# Altium project SwiftCtrl.PrjPcb
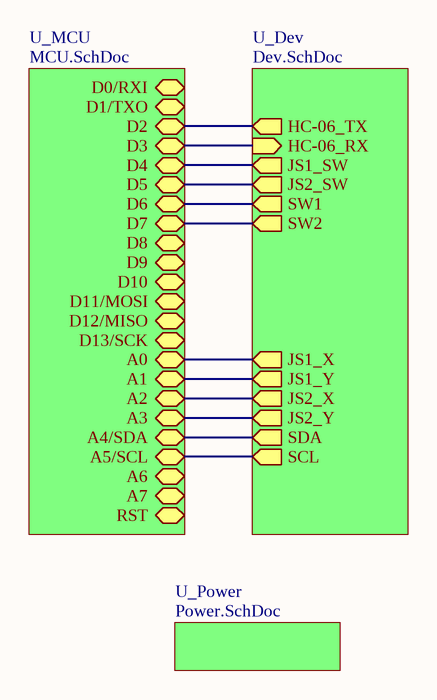
[diagram p0: SwiftCtrl.SchDoc]
4 sheets, 62 parts. Net scope: hierarchical (ports join the sheet entries above them; power ports are global).
Board file: SwiftCtrl.PcbDoc
Sheets:
  SwiftCtrl.SchDoc
    U_Dev = Dev.SchDoc
    U_Power = Power.SchDoc
    U_MCU = MCU.SchDoc

## Sheet SwiftCtrl.SchDoc
size 292 x 193 mm; Author: Power Lin; DocumentNumber: 1; SheetNumber: 1; SheetTotal: 4; Website: wiki-power.com

### Sub-sheets
U_Dev = Dev.SchDoc: JS1_SW (out), JS1_Y (out), JS1_X (out), JS2_SW (out), JS2_Y (out), JS2_X (out), SDA (out), SCL (out), HC-06_TX (out), HC-06_RX (in), SW1 (out), SW2 (out)
U_MCU = MCU.SchDoc: D2 (bidir), D3 (bidir), D4 (bidir), D5 (bidir), D6 (bidir), D7 (bidir), A6 (bidir), A7 (bidir), D8 (bidir), D9 (bidir), D12/MISO (bidir), D10 (bidir), D11/MOSI (bidir), A0 (bidir), A1 (bidir), A4/SDA (bidir), A5/SCL (bidir), A2 (bidir), A3 (bidir), D13/SCK (bidir), RST (bidir), D0/RXI (bidir), D1/TXO (bidir)
U_Power = Power.SchDoc: no entries

### Nets
NetC9_2: sheet U_Dev/JS1_SW, sheet U_MCU/D4
NetC10_2: sheet U_Dev/JS2_SW, sheet U_MCU/D5
NetC11_2: sheet U_Dev/JS1_Y, sheet U_MCU/A1
NetC12_1: sheet U_Dev/JS2_Y, sheet U_MCU/A3
NetC13_1: sheet U_Dev/JS1_X, sheet U_MCU/A0
NetC14_2: sheet U_Dev/JS2_X, sheet U_MCU/A2
NetM1_3: sheet U_Dev/SCL, sheet U_MCU/A5/SCL
NetM1_4: sheet U_Dev/SDA, sheet U_MCU/A4/SDA
NetM2_1: sheet U_Dev/HC-06_TX, sheet U_MCU/D2
NetM2_2: sheet U_Dev/HC-06_RX, sheet U_MCU/D3
NetR9_1: sheet U_Dev/SW1, sheet U_MCU/D6
NetR11_1: sheet U_Dev/SW2, sheet U_MCU/D7

### Notes on the sheet
- Author
- DocumentName
- ModifiedDate
- ProjectName
- SheetNumber
- SheetTotal
- Website
- Revision

## Sheet Dev.SchDoc
size 292 x 193 mm; Author: Power Lin; DocumentNumber: 3; SheetNumber: 3; SheetTotal: 4; Website: wiki-power.com
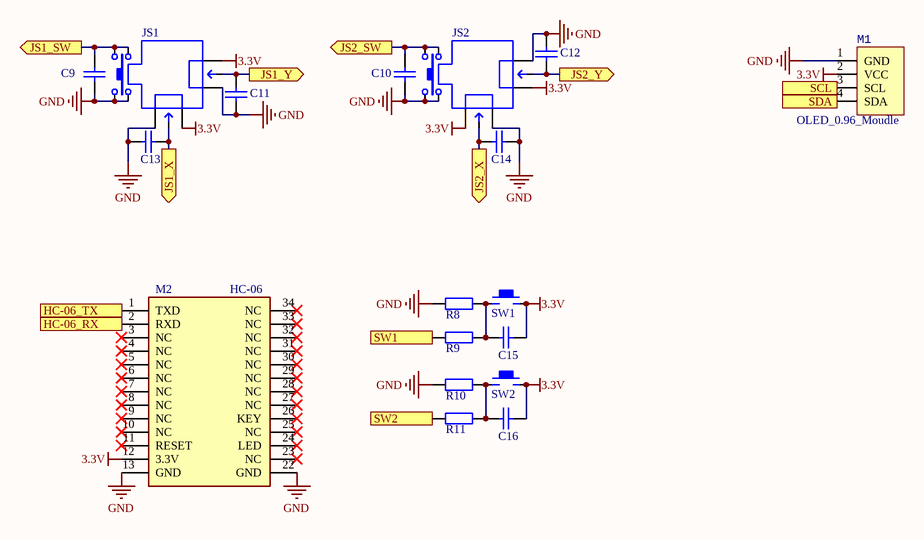
[diagram p1: Dev.SchDoc]

### Parts
C9  220pF  [CAP-0603]  (value not drawn)
C10  220pF  [CAP-0603]  (value not drawn)
C11  220pF  [CAP-0603]  (value not drawn)
C12  220pF  [CAP-0603]  (value not drawn)
C13  220pF  [CAP-0603]  (value not drawn)
C14  220pF  [CAP-0603]  (value not drawn)
C15  100nF  [CAP-0603]  (value not drawn)
C16  100nF  [CAP-0603]  (value not drawn)
JS1  JoyStick  [JoyStick]  (value not drawn)
JS2  JoyStick  [JoyStick]  (value not drawn)
M1  OLED_0.96_Moudle  [OLED_0.96_Moudle]
M2  HC-06  [HC-05/06/08V15]
R8  4.7k  [R-0603]  (value not drawn)
R9  1k  [R-0603]  (value not drawn)
R10  4.7k  [R-0603]  (value not drawn)
R11  1k  [R-0603]  (value not drawn)
SW1  KEY  [KEY_12*12*7.3]  (value not drawn)
SW2  KEY  [KEY_12*12*7.3]  (value not drawn)

### Ports
HC-06_RX (in), HC-06_TX (out), JS1_SW (out), JS1_X (out), JS1_Y (out), JS2_SW (out), JS2_X (out), JS2_Y (out), SCL (out), SDA (out), SW1 (out), SW2 (out)

### Nets
3.3V: C15.2 C16.2 JS1.3 JS1.6 JS2.1 JS2.4 M1.2(VCC) M2.12(3.3V) SW1.2 SW2.2
GND: C9.1 C10.1 C11.1 C12.2 C13.2 C14.1 JS1.1 JS1.4 JS1.8 JS1.10 JS2.3 JS2.6 JS2.8 JS2.10 M1.1(GND) M2.13(GND) M2.22(GND) R8.1 R10.1
NetC9_2: C9.2 JS1.7 JS1.9 ; port JS1_SW
NetC10_2: C10.2 JS2.7 JS2.9 ; port JS2_SW
NetC11_2: C11.2 JS1.5 ; port JS1_Y
NetC12_1: C12.1 JS2.5 ; port JS2_Y
NetC13_1: C13.1 JS1.2 ; port JS1_X
NetC14_2: C14.2 JS2.2 ; port JS2_X
NetC15_1: C15.1 R8.2 R9.2 SW1.1
NetC16_1: C16.1 R10.2 R11.2 SW2.1
NetM1_3: M1.3(SCL) ; port SCL
NetM1_4: M1.4(SDA) ; port SDA
NetM2_1: M2.1(TXD) ; port HC-06_TX
NetM2_2: M2.2(RXD) ; port HC-06_RX
NetR9_1: R9.1 ; port SW1
NetR11_1: R11.1 ; port SW2

Not connected (* = marked no-connect by the designer): M2 3(NC)* 4(NC)* 5(NC)* 6(NC)* 7(NC)* 8(NC)* 9(NC)* 10(NC)* 11(RESET)* 23(NC)* 24(LED)* 25(NC)* 26(KEY)* 27(NC)* 28(NC)* 29(NC)* 30(NC)* 31(NC)* 32(NC)* 33(NC)* 34(NC)*

### Notes on the sheet
- Author
- DocumentName
- ModifiedDate
- ProjectName
- SheetNumber
- SheetTotal
- Website
- Revision

### Library data of the parts
C9-C16 = CAP: 贴片电容; ComponentLink1Description: 供应商链接; ComponentLink1URL: http://www.szlcsc.com/product/details_53938.html; Package: 0402; Supplier: LC; SuppliersPartNumber: C52923
JS1 JS2 = JoyStick: 摇杆
M1 = OLED_0.96_Moudle: OLED 屏
M2 = HC-05/06: HC05/06 蓝牙模块（贴片）; Manufacturer_Name: FTDI Chip; Manufacturer_Part_Number: FT232RL; Datasheet Link: http://www.ftdichip.com/Support/Documents/DataSheets/ICs/DS_FT232R.pdf; Height: 2mm; RS Part Number: 0406580P; RS Price/Stock: http://uk.rs-online.com/web/p/products/0406580P
R8-R11 = RES: 贴片电阻; Package: 0805; Supplier: LC; SuppliersPartNumber: C17798
SW1 SW2 = KEY: 按键开关

## Sheet Power.SchDoc
size 292 x 193 mm; Author: Power Lin; DocumentNumber: 4; SheetNumber: 4; SheetTotal: 4; Website: wiki-power.com
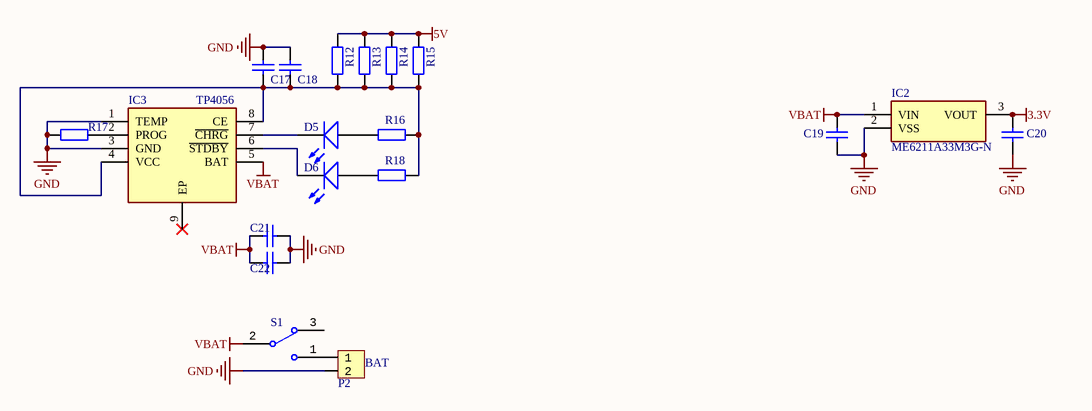
[diagram p2: Power.SchDoc]

### Parts
C17  10nF  [CAP-0603]  (value not drawn)
C18  100nF  [CAP-0603]  (value not drawn)
C19  1uF  [CAP-0603]  (value not drawn)
C20  1uF  [CAP-0603]  (value not drawn)
C21  100nF  [CAP-0603]  (value not drawn)
C22  10nF  [CAP-0603]  (value not drawn)
D5  RED  [LED-0603]  (value not drawn)
D6  RED  [LED-0603]  (value not drawn)
IC2  ME6211A33M3G-N  [SOT-23-3]
IC3  TP4056  [MSOP_E120_P0.5_10]
P2  HDR1x2_2.54  [HDR1X2_2.54_90]  (value not drawn)
R12  1R  [R-0603]  (value not drawn)
R13  1R  [R-0603]  (value not drawn)
R14  1R  [R-0603]  (value not drawn)
R15  1R  [R-0603]  (value not drawn)
R16  2K  [R-0603]  (value not drawn)
R17  1.2K  [R-0603]  (value not drawn)
R18  10K  [R-0603]  (value not drawn)
S1  Switch_SPDT  [SwitchSPDT_2.8X6.6_90]  (value not drawn)

### Nets
3.3V: C20.2 IC2.3(VOUT)
5V: R12.2 R13.2 R14.2 R15.2
GND: C17.2 C18.2 C19.1 C20.1 C21.1 C22.1 IC2.2(VSS) IC3.1(TEMP) IC3.3(GND) P2.2 R17.1
VBAT: C19.2 C21.2 C22.2 IC2.1(VIN) IC3.5(BAT) S1.2
NetC17_1: C17.1 C18.1 IC3.4(VCC) IC3.8(CE) R12.1 R13.1 R14.1 R15.1 R16.2 R18.2
NetD5_A: D5.A R16.1
NetD5_K: D5.K IC3.7(~{CHRG})
NetD6_A: D6.A R18.1
NetD6_K: D6.K IC3.6(~{STDBY})
NetIC3_2: IC3.2(PROG) R17.2
NetP2_1: P2.1 S1.1

Not connected (* = marked no-connect by the designer): IC3 9(EP)*; S1 3

### Notes on the sheet
- (near P2) BAT
- Author
- DocumentName
- ModifiedDate
- ProjectName
- SheetNumber
- SheetTotal
- Website
- Revision

### Library data of the parts
C17-C22 = CAP: 贴片电容; ComponentLink1Description: 供应商链接; ComponentLink1URL: http://www.szlcsc.com/product/details_53938.html; Package: 0402; Supplier: LC; SuppliersPartNumber: C52923
D5 D6 = LED: 发光二极管; pin to pad: A>1 K>2; ComponentLink1Description: 供应商链接; ComponentLink1URL: http://www.szlcsc.com/product/details_2663.html; Package: 0603; Supplier: LC; SuppliersPartNumber: C2290
IC2 = ME6211A33M3G-N: 线性稳压; Manufacturer_Name: Nexperia; Manufacturer_Part_Number: SI2302DS; Datasheet Link: https://assets.nexperia.com/documents/data-sheet/SI2302DS.pdf; Height: 1.1mm; Mouser Part Number: N/A; Mouser Price/Stock: https://www.mouser.com/Search/Refine.aspx?Keyword=N%2FA; RS Part Number: 7983053P; RS Price/Stock: http://uk.rs-online.com/web/p/products/7983053P
IC3 = TP4056: 锂电池充电（1A 线性）; Manufacturer_Name: Nanjing Extension Microelectronics; Manufacturer_Part_Number: TP4056-42-ESOP8; Datasheet Link: https://datasheet.lcsc.com/szlcsc/1906261508_Nanjing-Extension-Microelectronics-TP4056-42-ESOP8_C16581.pdf; Height: 1.75mm
P2 = HDR1x2_2.54: Header
R12-R18 = RES: 贴片电阻; Package: 0805; Supplier: LC; SuppliersPartNumber: C17798
S1 = Switch_SPDT: Value: SPDT 3P; Type: SPDT

## Sheet MCU.SchDoc
size 292 x 193 mm; Author: Power Lin; DocumentNumber: 2; SheetNumber: 2; SheetTotal: 4; Website: wiki-power.com
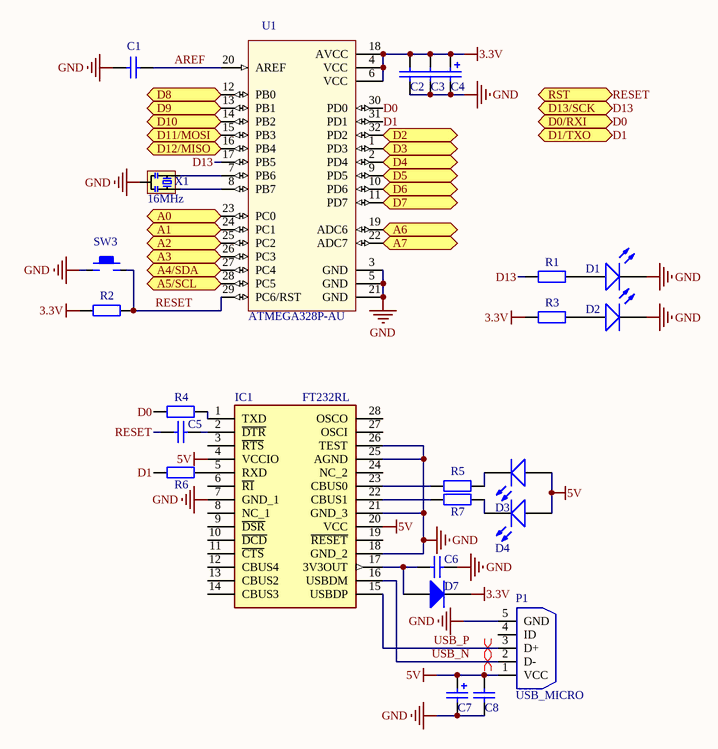
[diagram p3: MCU.SchDoc]

### Parts
C1  100nF  [CAP-0603]  (value not drawn)
C2  1uF  [CAP-0603]  (value not drawn)
C3  1uF  [CAP-0603]  (value not drawn)
C4  4.7uF 16V  [CAP-AUX-3216]  (value not drawn)
C5  100nF  [CAP-0603]  (value not drawn)
C6  100nF  [CAP-0603]  (value not drawn)
C7  4.7uF 16V  [CAP-AUX-3216]  (value not drawn)
C8  100nF  [CAP-0603]  (value not drawn)
D1  GREEN  [LED-0603]  (value not drawn)
D2  RED  [LED-0603]  (value not drawn)
D3  RED  [LED-0603]  (value not drawn)
D4  RED  [LED-0603]  (value not drawn)
D7  SS14  [SOD_123]  (value not drawn)
IC1  FT232RL  [SSOP]
P1  USB_MICRO  [Micro usb座 -全贴片]
R1  330R  [R-0603]  (value not drawn)
R2  1K  [R-0603]  (value not drawn)
R3  10K  [R-0603]  (value not drawn)
R4  1K  [R-0603]  (value not drawn)
R5  1K  [R-0603]  (value not drawn)
R6  1K  [R-0603]  (value not drawn)
R7  1K  [R-0603]  (value not drawn)
SW3  KEY  [KEY-4P-4.2*3.4*2.5]  (value not drawn)
U1  ATMEGA328P-AU  [TQFP-32_7x7x08P]
X1  16MHz  [CSTCE_G(A)村田晶振]

### Ports
A0 (bidir), A1 (bidir), A2 (bidir), A3 (bidir), A4/SDA (bidir), A5/SCL (bidir), A6 (bidir), A7 (bidir), D0/RXI (bidir), D1/TXO (bidir), D2 (bidir), D3 (bidir), D4 (bidir), D5 (bidir), D6 (bidir), D7 (bidir), D8 (bidir), D9 (bidir), D10 (bidir), D11/MOSI (bidir), D12/MISO (bidir), D13/SCK (bidir), RST (bidir)

### Nets
3.3V: C2.2 C3.2 C4.1 D7.2(K) R2.1 R3.1 U1.4(VCC) U1.6(VCC) U1.18(AVCC)
5V: C7.1 C8.2 D3.A D4.A IC1.4(VCCIO) IC1.20(VCC) P1.1(VCC)
GND: C1.1 C2.1 C3.1 C4.2 C6.1 C7.2 C8.1 D1.K D2.K IC1.7(GND_1) IC1.18(GND_2) IC1.21(GND_3) IC1.25(AGND) IC1.26(TEST) P1.5(GND) SW3.1 U1.3(GND) U1.5(GND) U1.21(GND) X1.2(GND)
AREF: C1.2 U1.20(AREF)
D0: R4.1 U1.30(PD0) ; port D0/RXI
D1: R6.1 U1.31(PD1) ; port D1/TXO
D13: R1.1 U1.17(PB5) ; port D13/SCK
RESET: C5.2 R2.2 SW3.2 U1.29(PC6/RST) ; port RST
USB_N: IC1.16(USBDM) P1.2(D-)
USB_P: IC1.15(USBDP) P1.3(D+)
NetC5_1: C5.1 IC1.2(~{DTR})
NetC6_2: C6.2 D7.1(A) IC1.17(3V3OUT)
NetC9_2: U1.2(PD4) ; port D4
NetC10_2: U1.9(PD5) ; port D5
NetC11_2: U1.24(PC1) ; port A1
NetC12_1: U1.26(PC3) ; port A3
NetC13_1: U1.23(PC0) ; port A0
NetC14_2: U1.25(PC2) ; port A2
NetD1_A: D1.A R1.2
NetD2_A: D2.A R3.2
NetD3_K: D3.K R5.2
NetD4_K: D4.K R7.2
NetIC1_1: IC1.1(TXD) R4.2
NetIC1_5: IC1.5(RXD) R6.2
NetIC1_22: IC1.22(CBUS1) R7.1
NetIC1_23: IC1.23(CBUS0) R5.1
NetM1_3: U1.28(PC5) ; port A5/SCL
NetM1_4: U1.27(PC4) ; port A4/SDA
NetM2_1: U1.32(PD2) ; port D2
NetM2_2: U1.1(PD3) ; port D3
NetR9_1: U1.10(PD6) ; port D6
NetR11_1: U1.11(PD7) ; port D7
NetU1_7: U1.7(PB6) X1.1(OSC1)
NetU1_8: U1.8(PB7) X1.3(OSC2)
NetU1_12: U1.12(PB0) ; port D8
NetU1_13: U1.13(PB1) ; port D9
NetU1_14: U1.14(PB2) ; port D10
NetU1_15: U1.15(PB3) ; port D11/MOSI
NetU1_16: U1.16(PB4) ; port D12/MISO
NetU1_19: U1.19(ADC6) ; port A6
NetU1_22: U1.22(ADC7) ; port A7

Not connected (* = marked no-connect by the designer): IC1 3(~{RTS}) 6(~{RI}) 8(NC_1) 9(~{DSR}) 10(~{DCD}) 11(~{CTS}) 12(CBUS4) 13(CBUS2) 14(CBUS3) 19(~{RESET}) 24(NC_2) 27(OSCI) 28(OSCO); P1 4(ID)

### Layout directives
differential pair: USB_N, USB_P

### Notes on the sheet
- Author
- DocumentName
- ModifiedDate
- ProjectName
- SheetNumber
- SheetTotal
- Website
- Revision

### Library data of the parts
C1-C3 C5 C6 C8 = CAP: 贴片电容; ComponentLink1Description: 供应商链接; ComponentLink1URL: http://www.szlcsc.com/product/details_53938.html; Package: 0402; Supplier: LC; SuppliersPartNumber: C52923
C4 C7 = CAP-POL: 贴片电容-有极性; ComponentLink1Description: 供应商链接; ComponentLink1URL: http://www.szlcsc.com/product/details_16815.html; Package: 3528; Supplier: LC; SuppliersPartNumber: C16133
D1-D4 = LED: 发光二极管; pin to pad: A>1 K>2; ComponentLink1Description: 供应商链接; ComponentLink1URL: http://www.szlcsc.com/product/details_2663.html; Package: 0603; Supplier: LC; SuppliersPartNumber: C2290
D7 = DIODE: 二极管; ComponentLink1Description: 供应商链接; ComponentLink1URL: http://www.szlcsc.com/product/details_23178.html; Package: SMA(DO-214AC); Supplier: LC; SuppliersPartNumber: C22452
IC1 = FT232RL: USB to UART; Manufacturer_Name: FTDI Chip; Datasheet Link: http://www.ftdichip.com/Support/Documents/DataSheets/ICs/DS_FT232R.pdf; Height: 2mm; Manufacturer_Part_Number: FT232RL; RS Part Number: 0406580P; RS Price/Stock: http://uk.rs-online.com/web/p/products/0406580P
P1 = USB_MICRO: USB 接口
R1-R7 = RES: 贴片电阻; Package: 0805; Supplier: LC; SuppliersPartNumber: C17798
SW3 = KEY: 按键开关
U1 = ATMEGA328P-AU: 微控制器, 8 Bit, Atmega, 20mhz, Tqfp-32; MF: Microchip; SnapEDA_Link: https://www.snapeda.com/parts/ATMEGA328P-AU/Microchip/view-part/?ref=snap; Availability: Unavailable; Price: None; MP: ATMEGA328P-AU; Package: TQFP-32 Microchip; Value: *
X1 = XTAL: 有源晶振

## Nets that join several sheets
3.3V: Dev (10 pins), Power (C20.2 IC2.3), MCU (9 pins)
5V: Power (R12.2 R13.2 R14.2 R15.2), MCU (7 pins)
GND: Dev (19 pins), Power (11 pins), MCU (20 pins)
NetC9_2: Dev (C9.2 JS1.7 JS1.9), MCU (U1.2)
NetC10_2: Dev (C10.2 JS2.7 JS2.9), MCU (U1.9)
NetC11_2: Dev (C11.2 JS1.5), MCU (U1.24)
NetC12_1: Dev (C12.1 JS2.5), MCU (U1.26)
NetC13_1: Dev (C13.1 JS1.2), MCU (U1.23)
NetC14_2: Dev (C14.2 JS2.2), MCU (U1.25)
NetM1_3: Dev (M1.3), MCU (U1.28)
NetM1_4: Dev (M1.4), MCU (U1.27)
NetM2_1: Dev (M2.1), MCU (U1.32)
NetM2_2: Dev (M2.2), MCU (U1.1)
NetR9_1: Dev (R9.1), MCU (U1.10)
NetR11_1: Dev (R11.1), MCU (U1.11)